# EasyEDA schematic 主板原理图·.json
TITLE: Sheet_1; REV: 1.0; Date: 2022-01-06; Sheet: 1/1; Drawn By: FranHawk; Company: Your Company
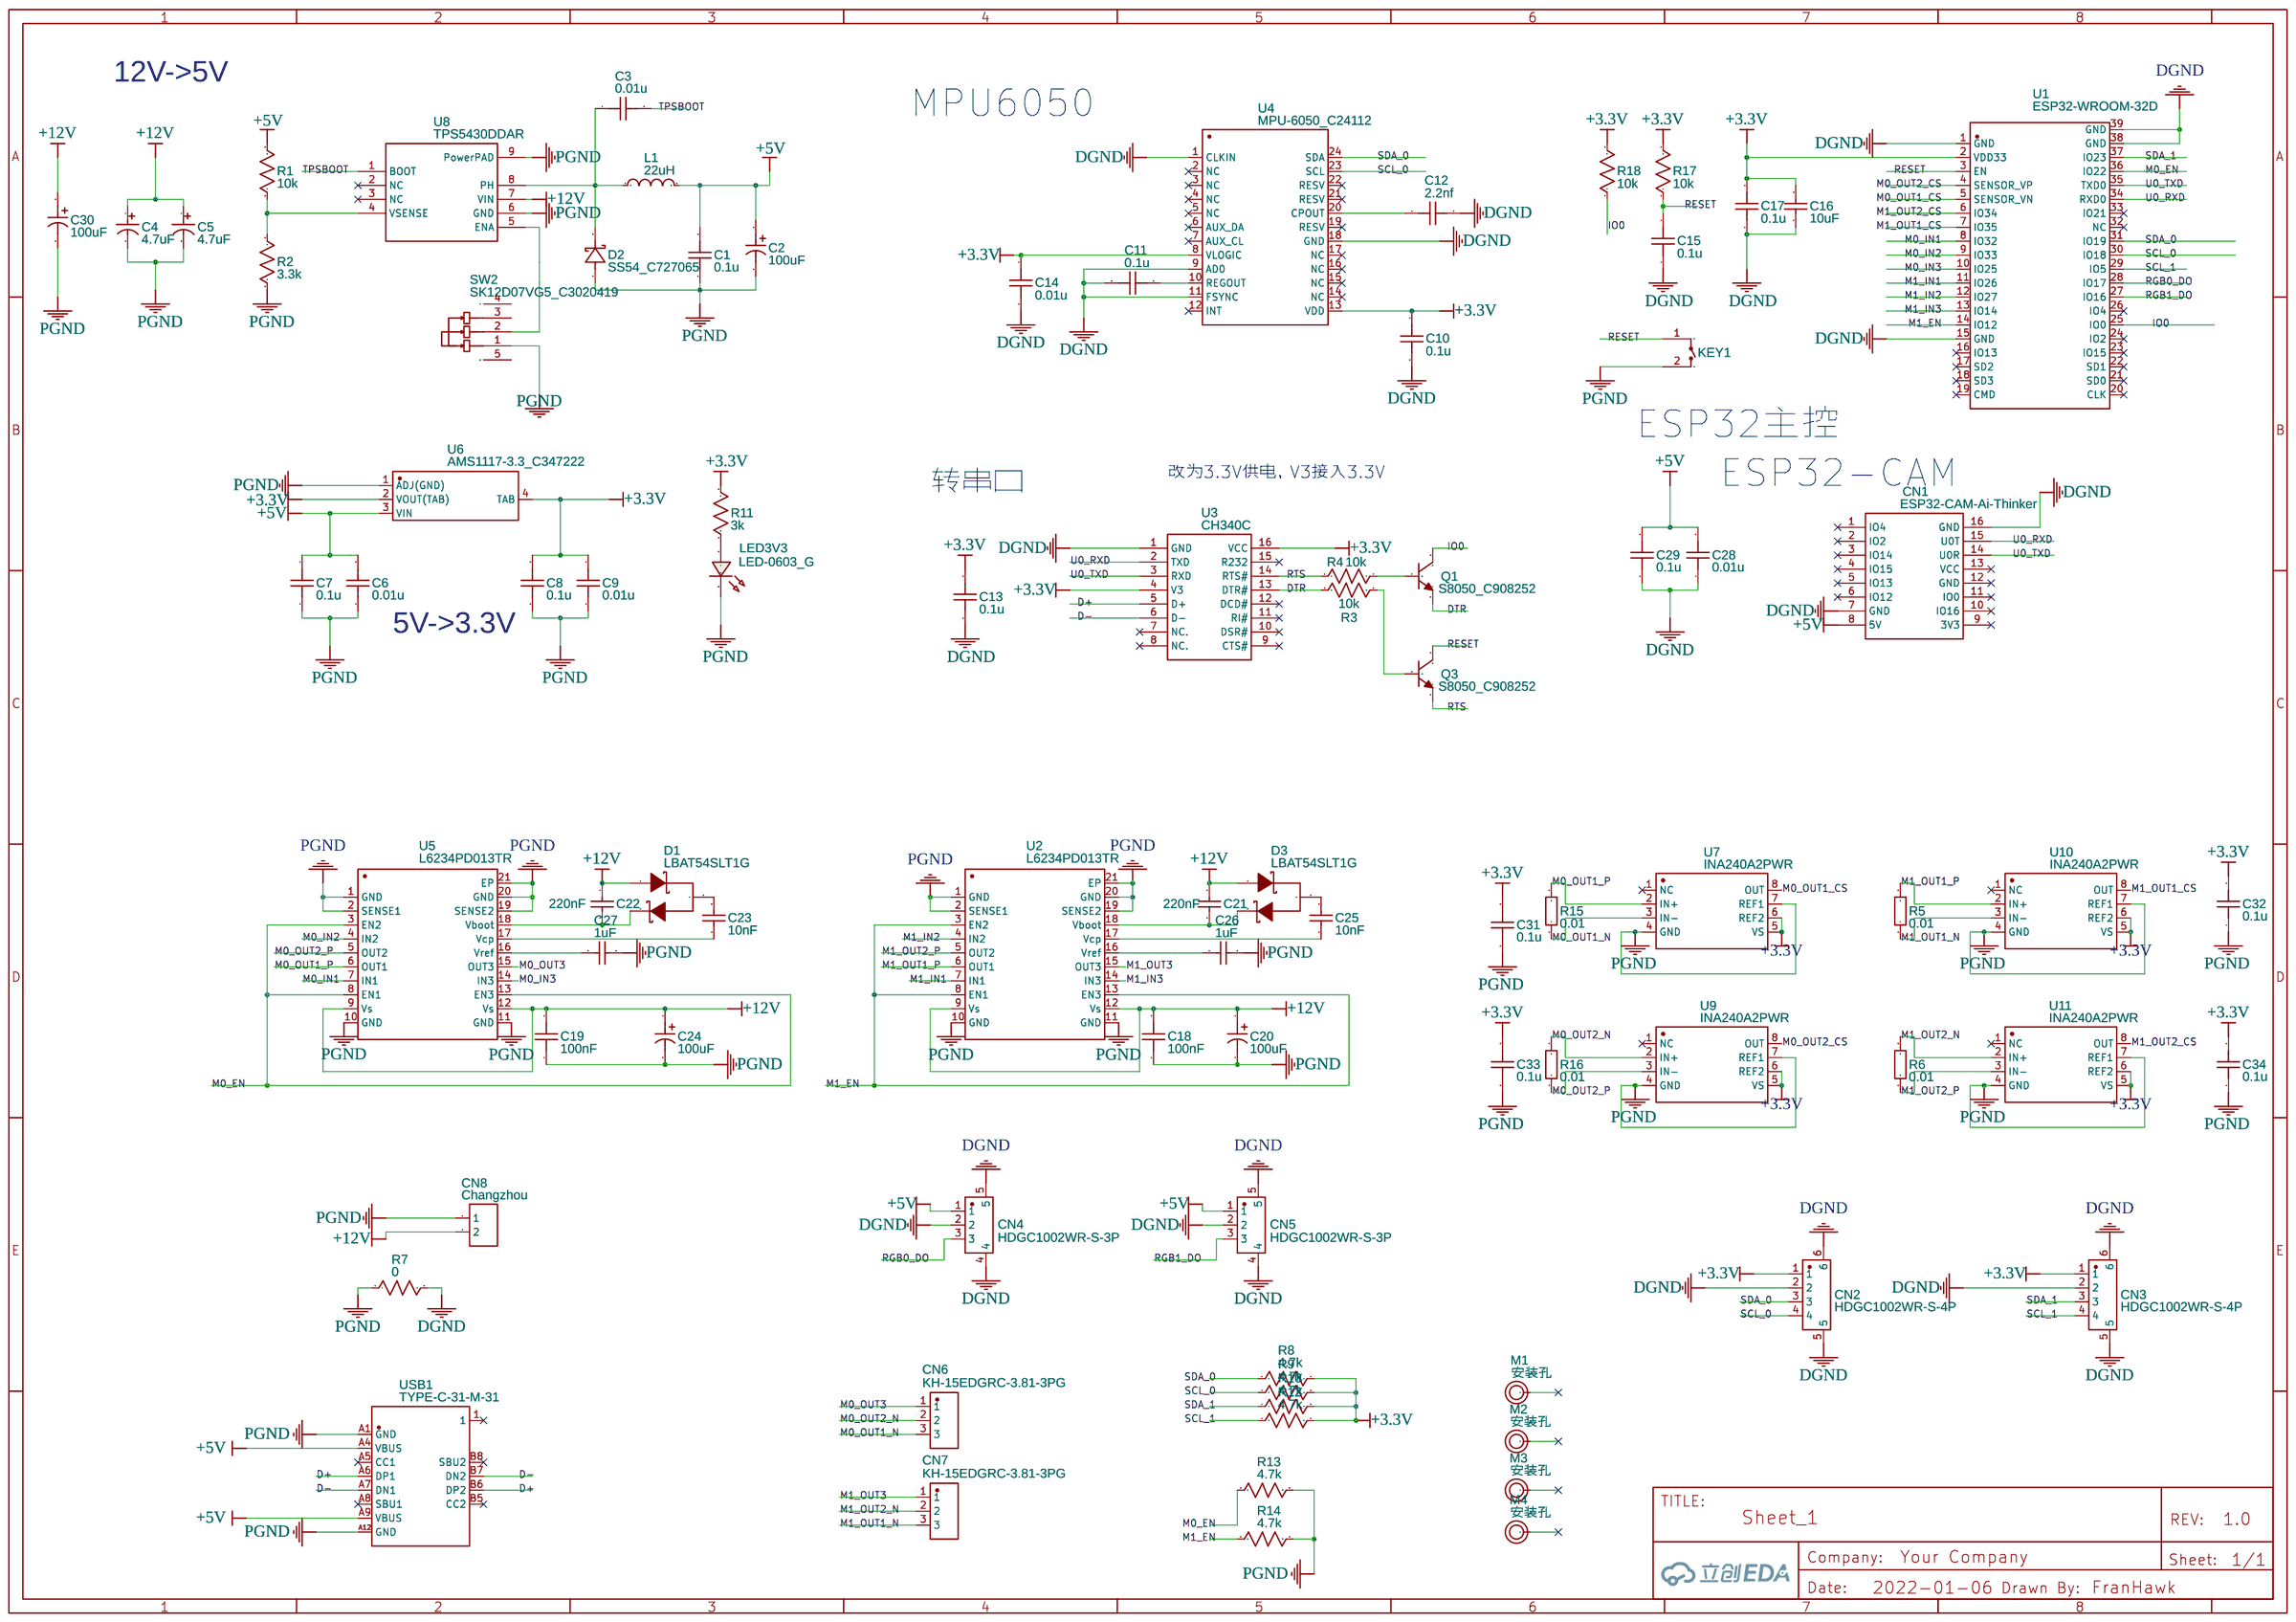
[diagram p0: schematic sheet]

## Parts
C1  0.1u  [C0603]
C2  100uF  [CAP-TH_BD10.0-P5.00-D0.6-FD]
C3  0.01u  [C0603]
C4  4.7uF  [CAP-TH_BD5.0-P2.00-D0.8-FD]
C5  4.7uF  [CAP-TH_BD5.0-P2.00-D0.8-FD]
C6  0.01u  [C0603]
C7  0.1u  [C0603]
C8  0.1u  [C0603]
C9  0.01u  [C0603]
C10  0.1u  [C0603]
C11  0.1u  [C0603]
C12  2.2nf  [C0603]
C13  0.1u  [C0603]
C14  0.01u  [C0603]
C15  0.1u  [C0603]
C16  10uF  [C1206]
C17  0.1u  [C0603]
C18  100nF  [C0603]
C19  100nF  [C0603]
C20  100uF  [CAP-TH_BD10.0-P5.00-D0.6-FD]
C21  220nF  [C0603]
C22  220nF  [C0603]
C23  10nF  [C0603]
C24  100uF  [CAP-TH_BD10.0-P5.00-D0.6-FD]
C25  10nF  [C0603]
C26  1uF  [C0603]
C27  1uF  [C0603]
C28  0.01u  [C0603]
C29  0.1u  [C0603]
C30  100uF  [CAP-TH_BD10.0-P5.00-D0.6-FD]
C31  0.1u  [C0603]
C32  0.1u  [C0603]
C33  0.1u  [C0603]
C34  0.1u  [C0603]
CN1  ESP32-CAM-Ai-Thinker  [ESP32-CAM]
CN2  HDGC1002WR-S-4P  [CONN-SMD_4P-P1.00_HDGC_HDGC1002WR-S-4P]
CN3  HDGC1002WR-S-4P  [CONN-SMD_4P-P1.00_HDGC_HDGC1002WR-S-4P]
CN4  HDGC1002WR-S-3P  [CONN-SMD_3P-P1.00_HDGC_HDGC1002WR-S-3P]
CN5  HDGC1002WR-S-3P  [CONN-SMD_3P-P1.00_HDGC_HDGC1002WR-S-3P]
CN6  KH-15EDGRC-3.81-3PG  [CONN-TH_KH-15EDGRC-3.81-3PG]
CN7  KH-15EDGRC-3.81-3PG  [CONN-TH_KH-15EDGRC-3.81-3PG]
CN8  Changzhou  [CONN-TH_XT30UPB-F]
D1  LBAT54SLT1G  [SOT-23_L2.9-W1.3-P1.90-LS2.4-BR]
D2  SS54_C727065  [SMA_L4.3-W2.6-LS5.0-RD]
D3  LBAT54SLT1G  [SOT-23_L2.9-W1.3-P1.90-LS2.4-BR]
KEY1  TS-1101S-B-B-B-W-A  [SW-SMD_L6.0-W3.5-LS8.0]
L1  22uH  [IND-SMD_L3.5-W3.0]
LED3V3  LED-0603_G  [LED0603_GREEN]
M1  安装孔  [M3安装孔]
M2  安装孔  [M3安装孔]
M3  安装孔  [M3安装孔]
M4  安装孔  [M3安装孔]
Q1  S8050_C908252  [SOT-23-3_L2.9-W1.3-P1.90-LS2.4-BR]
Q3  S8050_C908252  [SOT-23-3_L2.9-W1.3-P1.90-LS2.4-BR]
R1  10k  [R0603]
R2  3.3k  [R0603]
R3  10k  [R0603]
R4  10k  [R0603]
R5  0.01  [R1206]
R6  0.01  [R1206]
R7  0  [R0603]
R8  4.7k  [R0603]
R9  4.7k  [R0603]
R10  4.7k  [R0603]
R11  3k  [R0603]
R12  4.7k  [R0603]
R13  4.7k  [R0603]
R14  4.7k  [R0603]
R15  0.01  [R1206]
R16  0.01  [R1206]
R17  10k  [R0603]
R18  10k  [R0603]
SW2  SK12D07VG5_C3020419  [SW-TH_SHOU_SK12D07VG5]
U1  ESP32-WROOM-32D  [WIFIM-SMD_39P-L25.5-W18.0-P1.27-BL]
U2  L6234PD013TR  [POWERSO20_L15.9-W11.0-P1.27-LS14.2-BL-EP]
U3  CH340C  [SOP-16_L10.0-W3.9-P1.27-LS6.0-BL]
U4  MPU-6050_C24112  [QFN-24_L4.0-W4.0-P0.50-BL-MPU-6050]
U5  L6234PD013TR  [POWERSO20_L15.9-W11.0-P1.27-LS14.2-BL-EP]
U6  AMS1117-3.3_C347222  [SOT-223_L6.7-W3.5-P2.30-BR]
U7  INA240A2PWR  [TSSOP-8_L4.4-W3.0-P0.65-LS6.4-BL]
U8  TPS5430DDAR  [SOIC-8_L5.0-W4.0-P1.27-LS6.0-BL-EP]
U9  INA240A2PWR  [TSSOP-8_L4.4-W3.0-P0.65-LS6.4-BL]
U10  INA240A2PWR  [TSSOP-8_L4.4-W3.0-P0.65-LS6.4-BL]
U11  INA240A2PWR  [TSSOP-8_L4.4-W3.0-P0.65-LS6.4-BL]
USB1  TYPE-C-31-M-31  [USB-C-SMD_TYPE-C-31-M-31]

## Library data of the parts
C1 C3 C6-C15 C17 C28 C29 C31-C34 = C_0603_US: Contributor: LCEDA_Lib
C2 C20 C24 C30 = LZ101M0801013PE3: Supplier: LCSC; Supplier Part: C2847237; Manufacturer: UNITED(怡德); Contributor: LCSC; JLCPCB Part Class: Extended Part
C4 C5 = 4.7uF 50V 5*11: Supplier: LCSC; Manufacturer: ValuePro; Supplier Part: C43344; JLCPCB Part Class: Extended Part
C16 = CL31A106KAHNNNE: Supplier: LCSC; Manufacturer: SAMSUNG; Supplier Part: C9807; JLCPCB Part Class: Extended Part
C18 C19 = C0805X104K101T_C485772: Supplier: LCSC; Supplier Part: C485772; Manufacturer: HEC(Holy Stone Enterprise); Manufacturer Part: C0805X104K101T; Contributor: LCSC; JLCPCB Part Class: Extended Part
C21 C22 = CL21B224KBFNNNE: Supplier: LCSC; Manufacturer: SAMSUNG; LCSC Assembly: Yes; Supplier Part: C5378; SMT Type: Basic
C23 C25 = CL21A106KAYNNNE: Supplier: LCSC; Manufacturer: SAMSUNG; LCSC Assembly: Yes; Supplier Part: C15850; SMT Type: Basic
C26 C27 = CL21B105KBFNNNE: Supplier: LCSC; Manufacturer: SAMSUNG; LCSC Assembly: Yes; Supplier Part: C28323; SMT Type: Basic
CN1 = ESP32-CAM-Ai-Thinker: Contributor: lixi
CN2 CN3 = HDGC1002WR-S-4P: Supplier: LCSC; Supplier Part: C2936214; Manufacturer: HDGC(华德共创); Contributor: LCSC; JLCPCB Part Class: Extended Part
CN4 CN5 = HDGC1002WR-S-3P: Supplier: LCSC; Supplier Part: C2936213; Manufacturer: HDGC(华德共创); Contributor: LCSC
CN6 CN7 = KH-15EDGRC-3.81-3PG: Supplier: LCSC; Supplier Part: C2761212; Manufacturer: kinghelm(金航标); JLCPCB Part Class: Extended Part; Contributor: LCSC
CN8 = XT30UPB-F: Supplier: LCSC; Supplier Part: C108769; Manufacturer: Changzhou Amass Elec; Contributor: LCSC; JLCPCB Part Class: Extended Part
D1 D3 = LBAT54SLT1G: Supplier: LCSC; Manufacturer: LRC; image: //image.lceda.cn/szlcsc/C12765.jpg; Supplier Part: C12765; SMT Type: Extend; JLCPCB SMD: Yes
D2 = SS54_C727065: Supplier: LCSC; Supplier Part: C727065; Manufacturer: TWGMC; Manufacturer Part: SS54; Contributor: LCSC; Paste Type: Extended Part; JLCPCB Part Class: Extended Part
KEY1 = TS-1101S-B-B-B-W-A: Supplier: LCSC; Supplier Part: C692465; Manufacturer: XKB Connectivity; Contributor: LCSC
L1 = SM3521-220MT: Supplier: LCSC; Manufacturer: SXN; Supplier Part: C68387; JLCPCB Part Class: Extended Part
LED3V3 = LED-0603_G: Manufacturer: EVERLIGHT(台湾亿光); Manufacturer Part: 19-217/GHC-YR1S2/3T; Supplier Part: C72043; Supplier: LCSC; Contributor: LCEDA_Lib
M1-M4 = 安装孔: Supplier: yacter; Contributor: yacter
Q1 Q3 = S8050_C908252: Supplier: LCSC; Supplier Part: C908252; Manufacturer: FUXINSEMI; Manufacturer Part: S8050; Contributor: LCSC; JLCPCB Part Class: Extended Part
R1-R4 R7-R14 R17 R18 = R_0603_US: Contributor: LCEDA_Lib
R5 R6 R15 R16 = RTT06R010FTP: Supplier: LCSC; Manufacturer: RALEC; Contributor: LCSC; Supplier Part: C104920
SW2 = SK12D07VG5_C3020419: Supplier: LCSC; Supplier Part: C3020419; Manufacturer: SHOU HAN(首韩); Manufacturer Part: SK12D07VG5; link: https://atta.szlcsc.com/upload/public/pdf/source/20190925/C431548_D6571AEBDE139FDB1E6F8A4B1513A630.pdf; Contributor: lcsc
U1 = ESP32-WROOM-32D: Supplier: LCSC; Supplier Part: C473012; Manufacturer: ESPRESSIF 乐鑫; Contributor: LCSC; JLCPCB Part Class: Extended Part
U2 U5 = L6234PD013TR: Supplier: LCSC; Manufacturer: STMicroelectronics; Supplier Part: C77581
U3 = CH340C: Supplier: LCSC; Manufacturer: WCH; Supplier Part: C84681; JLCPCB Part Class: Extended Part
U4 = MPU-6050_C24112: sourceId: 1T5FDZYC8; Supplier: LCSC; Manufacturer: InvenSense; Manufacturer Part: MPU-6050; Supplier Part: C24112; JLCPCB Part Class: Basic Part
U6 = AMS1117-3.3_C347222: Supplier: LCSC; Supplier Part: C347222; Manufacturer: Youtai Semiconductor Co., Ltd.; Manufacturer Part: AMS1117-3.3; Contributor: LCSC; JLCPCB Part Class: Extended Part
U7 U9-U11 = INA240A2PWR: Supplier: LCSC; Manufacturer: TI; Contributor: LCSC; Supplier Part: C129949; Paste Type: expand
U8 = TPS5430DDAR: Supplier: LCSC; Manufacturer: TI; Supplier Part: C9864; JLCPCB Part Class: Basic Part
USB1 = TYPE-C-31-M-31: Supplier: LCSC; Supplier Part: C2760486; Manufacturer: 韩国韩荣; Contributor: LCSC; JLCPCB Part Class: Extended Part

## Nets
+3.3V: C8.2 C9.2 C10.1 C13.2 C14.1 C16.2 C17.2 C31.2 C32.2 C33.2 C34.2 CN2.1 CN3.1 R8.2 R9.2 R10.2 R11.2 R12.2 R17.2 R18.2 U1.2(VDD33) U3.4(V3) U3.16(VCC) U4.8(VLOGIC) U4.13(VDD) U6.2(VOUT(TAB)) U6.4(TAB) U7.5(VS) U7.6(REF2) U9.5(VS) U9.6(REF2) U10.5(VS) U10.6(REF2) U11.5(VS) U11.6(REF2)
+5V: C1.2 C2.1 C6.2 C7.2 C28.2 C29.2 CN1.8(5V) CN4.1 CN5.1 L1.2 R1.2 U6.3(VIN) USB1.A4(VBUS) USB1.A9(VBUS)
+12V: C4.1 C5.1 C18.2 C19.2 C20.1 C21.1 C22.1 C24.1 C30.1 CN8.2 D1.1(A) D3.1(A) U2.9(Vs) U2.12(Vs) U5.9(Vs) U5.12(Vs) U8.7(VIN)
DGND: C10.2 C11.2 C12.2 C13.1 C14.2 C15.1 C16.1 C17.1 C28.1 C29.1 CN1.7(GND) CN1.16(GND) CN2.2 CN2.5 CN2.6 CN3.2 CN3.5 CN3.6 CN4.2 CN4.4 CN4.5 CN5.2 CN5.4 CN5.5 R7.2 U1.1(GND) U1.15(GND) U1.38(GND) U1.39(GND) U3.1(GND) U4.1(CLKIN) U4.9(AD0) U4.11(FSYNC) U4.18(GND)
PGND: C1.1 C2.2 C4.2 C5.2 C6.1 C7.1 C8.1 C9.1 C18.1 C19.1 C20.2 C24.2 C26.2 C27.2 C30.2 C31.1 C32.1 C33.1 C34.1 CN8.1 D2.1(A) KEY1.2 LED3V3.2 R2.1 R7.1 R13.2 R14.2 SW2.1 U2.1(GND) U2.2(SENSE1) U2.10(GND) U2.11(GND) U2.19(SENSE2) U2.20(GND) U2.21(EP) U5.1(GND) U5.2(SENSE1) U5.10(GND) U5.11(GND) U5.19(SENSE2) U5.20(GND) U5.21(EP) U6.1(ADJ(GND)) U7.4(GND) U7.7(REF1) U8.6(GND) U8.9(PowerPAD) U9.4(GND) U9.7(REF1) U10.4(GND) U10.7(REF1) U11.4(GND) U11.7(REF1) USB1.A1(GND) USB1.A12(GND)
D+: U3.5(D+) USB1.A6(DP1) USB1.B6(DP2)
D-: U3.6(D-) USB1.A7(DN1) USB1.B7(DN2)
DTR: Q1.2(E) R3.1 U3.13(DTR#)
IO0: Q1.3(C) R18.1 U1.25(IO0)
M0_EN: R13.1 U1.36(IO22) U5.3(EN2) U5.8(EN1) U5.13(EN3)
M0_IN1: U1.8(IO32) U5.7(IN1)
M0_IN2: U1.9(IO33) U5.4(IN2)
M0_IN3: U1.10(IO25) U5.14(IN3)
M0_OUT1_CS: U1.5(SENSOR_VN) U7.8(OUT)
M0_OUT1_N: CN6.3 R15.1 U7.3(IN-)
M0_OUT1_P: R15.2 U5.6(OUT1) U7.2(IN+)
M0_OUT2_CS: U1.4(SENSOR_VP) U9.8(OUT)
M0_OUT2_N: CN6.2 R16.2 U9.2(IN+)
M0_OUT2_P: R16.1 U5.5(OUT2) U9.3(IN-)
M0_OUT3: CN6.1 U5.15(OUT3)
M1_EN: R14.1 U1.14(IO12) U2.3(EN2) U2.8(EN1) U2.13(EN3)
M1_IN1: U1.11(IO26) U2.7(IN1)
M1_IN2: U1.12(IO27) U2.4(IN2)
M1_IN3: U1.13(IO14) U2.14(IN3)
M1_OUT1_CS: U1.7(IO35) U10.8(OUT)
M1_OUT1_N: CN7.3 R5.1 U10.3(IN-)
M1_OUT1_P: R5.2 U2.6(OUT1) U10.2(IN+)
M1_OUT2_CS: U1.6(IO34) U11.8(OUT)
M1_OUT2_N: CN7.2 R6.2 U11.2(IN+)
M1_OUT2_P: R6.1 U2.5(OUT2) U11.3(IN-)
M1_OUT3: CN7.1 U2.15(OUT3)
RESET: C15.2 KEY1.1 Q3.3(C) R17.1 U1.3(EN)
RGB0_DO: CN4.3 U1.28(IO17)
RGB1_DO: CN5.3 U1.27(IO16)
RTS: Q3.2(E) R4.1 U3.14(RTS#)
SCL_0: CN2.4 R9.1 U1.30(IO18) U4.23(SCL)
SCL_1: CN3.4 R12.1 U1.29(IO5)
SDA_0: CN2.3 R8.1 U1.31(IO19) U4.24(SDA)
SDA_1: CN3.3 R10.1 U1.37(IO23)
TPSBOOT: C3.2 U8.1(BOOT)
U0_RXD: CN1.15(U0T) U1.34(RXD0) U3.2(TXD)
U0_TXD: CN1.14(U0R) U1.35(TXD0) U3.3(RXD)
Net-(C3-1): C3.1 D2.2(K) L1.1 U8.8(PH)
Net-(C11-1): C11.1 U4.10(REGOUT)
Net-(C12-1): C12.1 U4.20(CPOUT)
Net-(C21-2): C21.2 D3.2(K) U2.18(Vboot)
Net-(C22-2): C22.2 D1.2(K) U5.18(Vboot)
Net-(C23-1): C23.1 U5.17(Vcp)
Net-(C23-2): C23.2 D1.3(AK)
Net-(C25-1): C25.1 U2.17(Vcp)
Net-(C25-2): C25.2 D3.3(AK)
Net-(C26-1): C26.1 U2.16(Vref)
Net-(C27-1): C27.1 U5.16(Vref)
Net-(LED3V3-1): LED3V3.1 R11.1
Net-(Q1-1): Q1.1(B) R4.2
Net-(Q3-1): Q3.1(B) R3.2
Net-(R1-1): R1.1 R2.2 U8.4(VSENSE)
Net-(SW2-2): SW2.2 U8.5(ENA)

Not connected (* = marked no-connect by the designer): CN1 1(IO4)* 2(IO2)* 3(IO14)* 4(IO15)* 5(IO13)* 6(IO12)* 9(3V3)* 10(IO16)* 11(IO0)* 12(GND)* 13(VCC)*; M1 1; M2 1; M3 1; M4 1; SW2 3 4 5; U1 16(IO13)* 17(SD2)* 18(SD3)* 19(CMD)* 20(CLK)* 21(SD0)* 22(SD1)* 23(IO15)* 24(IO2)* 26(IO4)* 32(NC)* 33(IO21)*; U3 7(NC.)* 8(NC.)* 9(CTS#)* 10(DSR#)* 11(RI#)* 12(DCD#)* 15(R232)*; U4 2(NC)* 3(NC)* 4(NC)* 5(NC)* 6(AUX_DA)* 7(AUX_CL)* 12(INT)* 14(NC)* 15(NC)* 16(NC)* 17(NC)* 19(RESV)* 21(RESV)* 22(RESV)*; U7 1(NC)*; U8 2(NC)* 3(NC)*; U9 1(NC)*; U10 1(NC)*; U11 1(NC)*; USB1 1* A5(CC1)* A8(SBU1)* B5(CC2)* B8(SBU2)*

## Notes on the sheet
- 12V->5V
- MPU6050
- ESP32主控
- ESP32-CAM
- 转串口
- 改为3.3V供电，V3接入3.3V
- 5V->3.3V
